# EAGLE design 5Wled-mosfet_3 (EAGLE 6.2)
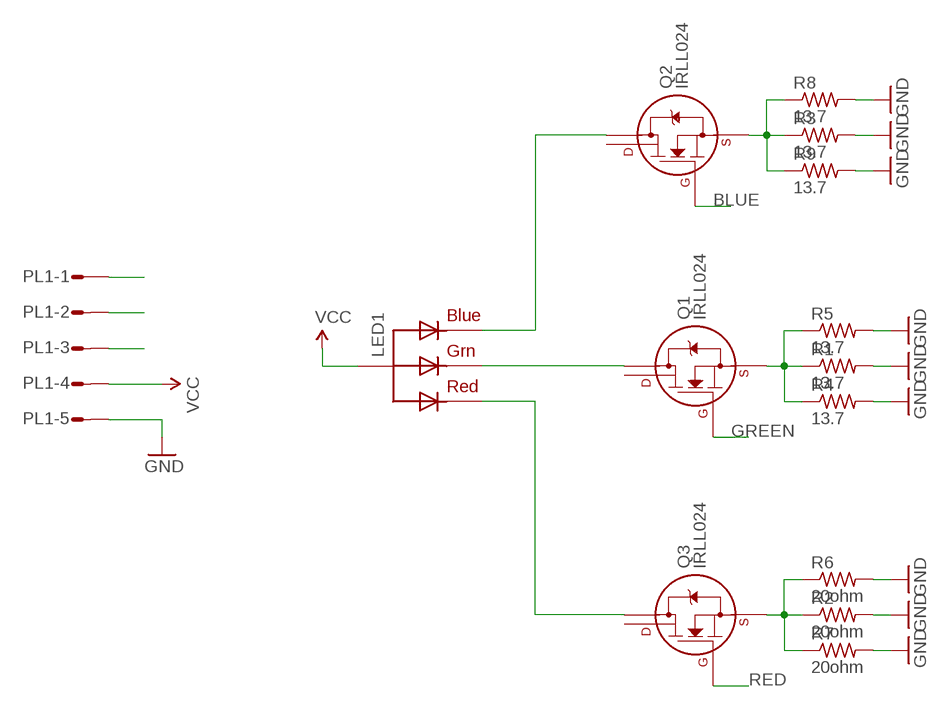
[diagram p0: schematic, sheet 1]

## Parts
LED1  RGBLED_CA4.5MM  [5WRGBLED]
PL1  DF3-05R  [DF3R-05]
Q1  IRLL024  [SOT-223]
Q2  IRLL024  [SOT-223]
Q3  IRLL024  [SOT-223]
R1  13.7  R-US_R1210  [R1210]
R2  20ohm  R-US_R1210  [R1210]
R3  13.7  R-US_R1210  [R1210]
R4  13.7  R-US_R1210  [R1210]
R5  13.7  R-US_R1210  [R1210]
R6  20ohm  R-US_R1210  [R1210]
R7  20ohm  R-US_R1210  [R1210]
R8  13.7  R-US_R1210  [R1210]
R9  13.7  R-US_R1210  [R1210]

## Nets
BLUE: PL1.3 Q2.1(G)
GND: PL1.5 R1.2 R2.2 R3.2 R4.2 R5.2 R6.2 R7.2 R8.2 R9.2
GREEN: PL1.1 Q1.1(G)
N$1: LED1.3(GREEN) Q1.2(D1)
N$2: LED1.1(BLUE) Q2.2(D1)
N$3: LED1.2(RED) Q3.2(D1)
N$4: Q1.3(S) R1.1 R4.1 R5.1
N$5: Q3.3(S) R2.1 R6.1 R7.1
N$6: Q2.3(S) R3.1 R8.1 R9.1
RED: PL1.2 Q3.1(G)
VCC: LED1.4(VCC) PL1.4
Unconnected: Q1.4(D2) Q2.4(D2) Q3.4(D2)

## Library data of the parts
LED1 = adafruit:RGBLED_CA: RGB LED, common-anode 5MM Staggered pins 5mm Piranha package http://www.ladyada.net/library/pcb/eaglelibrary.html
PL1 = con-hirose-df3:DF3-05: Single row connector 2mm 5 way
Q1-Q3 = transistors:IRLL*: International Rectifier IRLL series N-channel enhancement mode MOSFET HEXFET Power MOSFET SOT-223 Includes body diode
R1-R9 = adafruit:R-US_: RESISTOR, American symbol

## Board
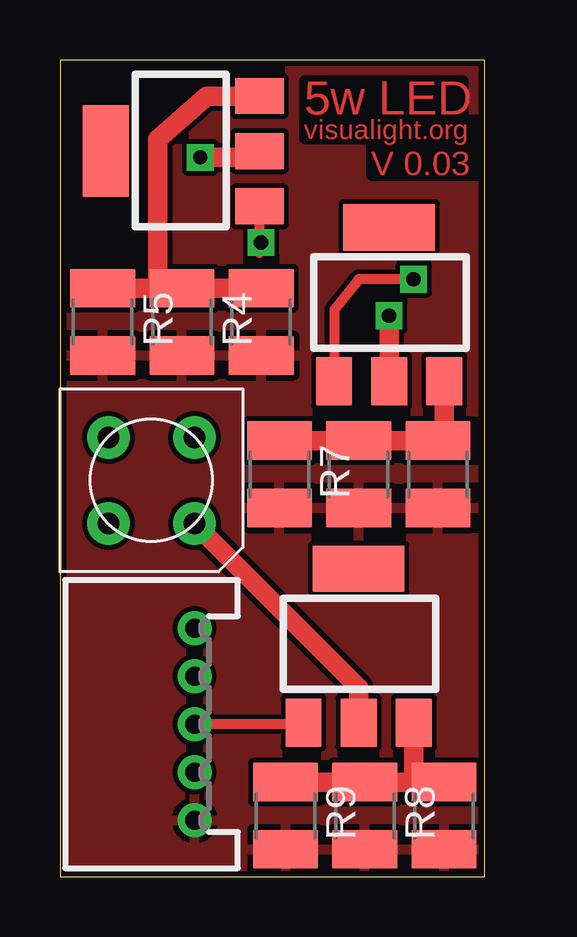
[diagram p1: board, top side]
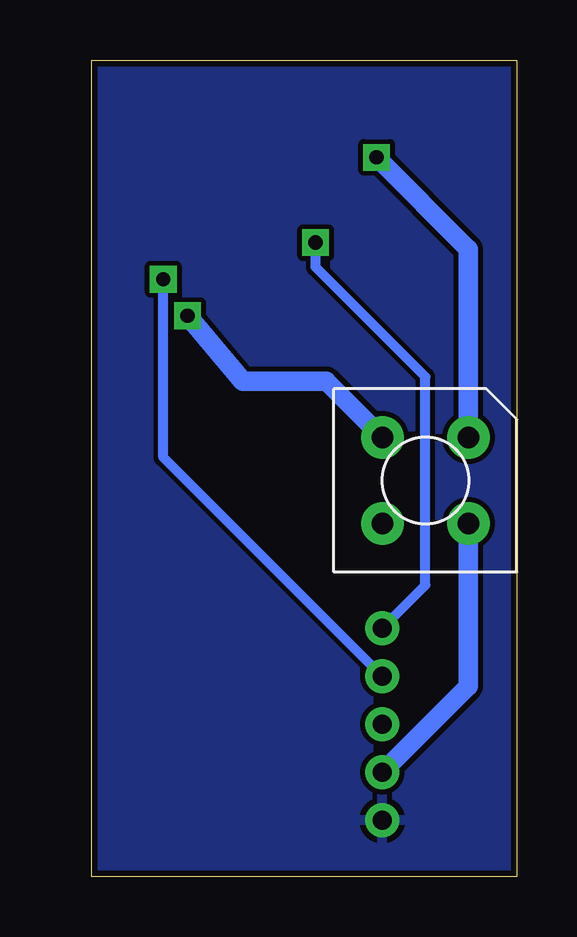
[diagram p2: board, bottom side, seen from below]

Size 17.7 x 34.03 mm. Coordinates in mm from the lower left corner, seen from the top.
Outline: 0,0 17.7,0 17.7,34.03 0,34.03 0,0
Copper layers (1*16): Top 0.035mm / dielectric 1.5mm / Bottom 0.035mm
Design rules: minimum track width 8mil, minimum drill 20mil, track to track 8mil, track to pad 8mil, pad to pad 8mil, via to via 8mil, smd to smd 8mil, copper to edge 10mil, drill to drill 8mil, minimum pad ring 12mil, minimum via ring 10mil, stop-mask expansion 4mil, vias tented up to drill 25mil, thermal gap 10mil

### Footprints (pad centres in the part's own frame; a part is rotated, then mirrored left to right if it is on the bottom)
5WRGBLED = drill 0.9 pad 1.778: 1 -1.79,1.79; 2 -1.79,-1.79; 3 1.79,-1.79; 4 1.79,1.79
DF3R-05 = drill 0.8: 1 -4,1.8; 2 -2,1.8; 3 0,1.8; 4 2,1.8; 5 4,1.8
SOT-223 = smd 1.499 x 2.007: 1 -2.3,-3.235; 2 0,-3.235; 3 2.3,-3.235 | smd 3.81 x 1.93: 4 0,3.175
R1210 = smd 1.6 x 2.7: 1 -1.4,0; 2 1.4,0

### Placement (x,y rotation side)
LED1  3.81,16.51 180 top
PL1  3.81,6.35 270 top
Q1  5.08,30.23 90 top
Q2  12.45,9.65 0 top
Q3  13.72,23.88 0 top
R1  8.38,23.11 270 top
R2  15.75,16.76 270 top
R3  16,2.54 270 top
R4  5.08,23.11 270 top
R5  1.78,23.11 270 top
R6  12.45,16.76 270 top
R7  9.14,16.76 270 top
R8  12.7,2.54 270 top
R9  9.4,2.54 270 top

### Tracks (layer width: path | path; a pad name or v marks a point on that pad's centre or on a via)
BLUE
  Top 0.406: Q2.1 9.96,6.35 PL1.3
GND
  pour Bottom: 0,34.04 17.78,34.04 17.78,0 0,0
  pour Top: 0,34.04 17.78,34.04 17.78,0 0,0
GREEN  (via drill 0.6)
  Top 0.406: v8.38,26.42 8.32,25.97 Q1.1
  Bottom 0.406: PL1.1 3.81,12.15 3.81,20.83 8.38,25.4 v8.38,26.42
N$1  (via drill 0.6)
  Top 0.813: Q1.2 8.06,29.97 v5.84,29.97
  Bottom 0.813: v5.84,29.97 2.02,26.15 LED1.3
N$2
  Top 0.813: Q2.2 12.45,7.87 LED1.1
N$3  (via drill 0.6)
  Top 0.813: v13.72,23.37 Q3.2
  Bottom 0.813: LED1.2 7.94,20.64 11.43,20.64 v13.72,23.37
N$4
  Top 0.813: Q1.3 6.11,32.53 4.06,30.73 4.06,24.51 | 4.06,24.51 R4.1 R1.1 | 4.06,24.51 R5.1
N$5
  Top 0.813: R7.1 R6.1 R2.1 16.02,18.39 Q3.3
N$6
  Top 0.813: Q2.3 14.75,3.91 R3.1 R8.1 R9.1
RED  (via drill 0.6)
  Top 0.406: v14.73,24.89 12.45,24.89 11.43,23.62 11.43,20.65 Q3.1
  Bottom 0.406: PL1.2 14.73,17.47 v14.73,24.89
VCC
  Bottom 0.813: LED1.4 2.02,7.94 PL1.4

### Text on the board
Top: 5w LED | visualight.org | V 0.03